# Altium schematic sheet Sheet1.SchDoc
size A3; SheetNumber: 1; SheetTotal: 1
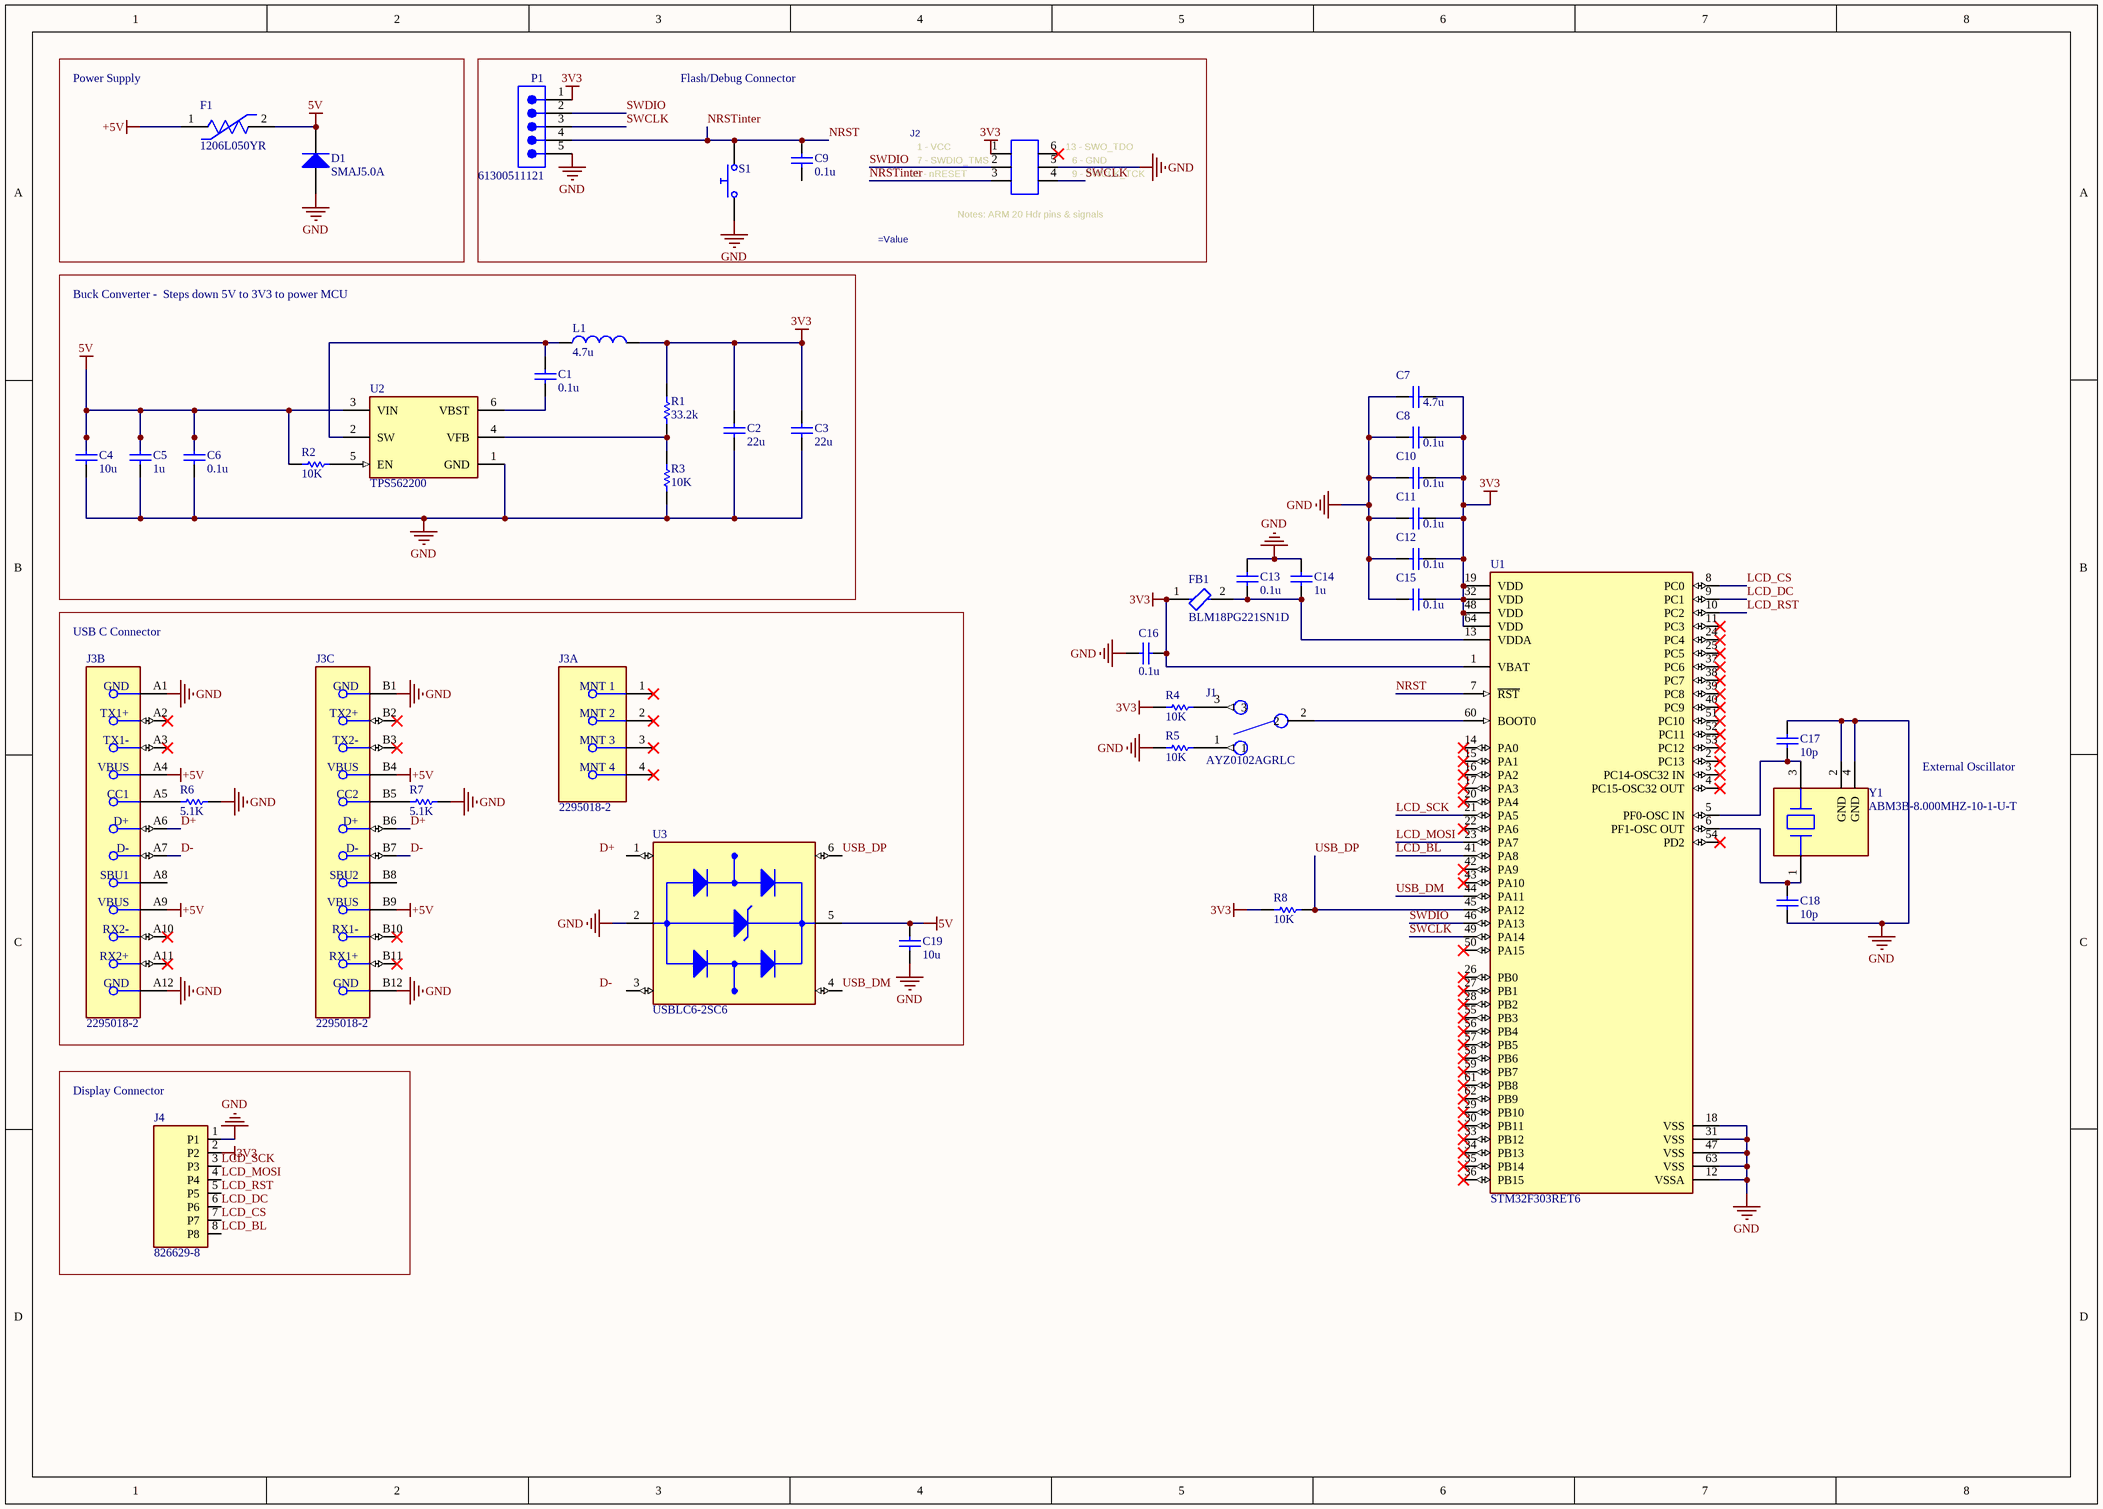
[diagram p0: Sheet1.SchDoc]

## Parts
C1  value 0.1u  (hidden comment: Capacitor)
C2  value 22u  (hidden comment: Capacitor)
C3  value 22u  (hidden comment: Capacitor)
C4  value 10u  (hidden comment: Capacitor)
C5  value 1u  (hidden comment: Capacitor)
C6  value 0.1u  (hidden comment: Capacitor)
C7  value 4.7u  (hidden comment: Capacitor)
C8  value 0.1u  (hidden comment: Capacitor)
C9  value 0.1u  (hidden comment: Capacitor)
C10  value 0.1u  (hidden comment: Capacitor)
C11  value 0.1u  (hidden comment: Capacitor)
C12  value 0.1u  (hidden comment: Capacitor)
C13  value 0.1u  (hidden comment: Capacitor)
C14  value 1u  (hidden comment: Capacitor)
C15  value 0.1u  (hidden comment: Capacitor)
C16  value 0.1u  (hidden comment: Capacitor)
C17  value 10p  (hidden comment: Capacitor)
C18  value 10p  (hidden comment: Capacitor)
C19  value 10u  (hidden comment: Capacitor)
D1  SMAJ5.0A  [BOUR-SMA-2_V]
F1  1206L050YR  [FP-1206L050YR-MFG]
FB1  BLM18PG221SN1D  [FP-BLM18-0_15-t0_8-IPC_B]
J1  AYZ0102AGRLC  [SW_AYZ0102AGRLC]
J2  (no value)  [TC2030-IDC]  (no BOM)
J3  2295018-2  [FP-2295018-2-MFG]  (parts A,B,C of 3)
J4  826629-8  [TE_826629-8]
L1  value 4.7u  (hidden comment: Inductor)
P1  61300511121  [61300511121]
R1  value 33.2k  (hidden comment: Resistor)
R2  value 10K  (hidden comment: Resistor)
R3  value 10K  (hidden comment: Resistor)
R4  value 10K  (hidden comment: Resistor)
R5  value 10K  (hidden comment: Resistor)
R6  value 5.1K  (hidden comment: Resistor)
R7  value 5.1K  (hidden comment: Resistor)
R8  value 10K  (hidden comment: Resistor)
S1  Push Button Normally Opened  (value not drawn)
U1  STM32F303RET6  [FP-LQFP64-5W-MFG]
U2  TPS562200  [FP-DDC0006A-MFG]
U3  USBLC6-2SC6  [SOT95P280X145-6N]
Y1  ABM3B-8.000MHZ-10-1-U-T  [FP-ABM3B-MFG]

## Blocks framed on the sheet
Power Supply: D1 F1
Flash/Debug Connector: C9 J2 P1 S1
Buck Converter -  Steps down 5V to 3V3 to power MCU: C1-C6 L1 R1-R3 U2
USB C Connector: C19 J3 R6 R7 U3
Display Connector: J4

## Nets
3V3: C2.2 C3.2 C7.1 C8.1 C10.1 C11.1 C12.1 C15.1 C16.2 FB1.1 J2.1 J4.2(P2) L1.2 P1.1 R1.1 R4.1 R8.1 U1.1(VBAT) U1.19(VDD) U1.32(VDD) U1.48(VDD) U1.64(VDD)
5V: C4.2 C5.2 C6.2 C19.2 D1.2(K) F1.2 R2.2 U2.3(VIN) U3.5(VBUS)
+5V: F1.1 J3.A4(VBUS) J3.A9(VBUS) J3.B4(VBUS) J3.B9(VBUS)
GND: C2.1 C3.1 C4.1 C5.1 C6.1 C7.2 C8.2 C10.2 C11.2 C12.2 C13.1 C14.2 C15.2 C16.1 C17.1 C18.2 C19.1 D1.1(A) J2.5 J3.A1(GND) J3.A12(GND) J3.B1(GND) J3.B12(GND) J4.1(P1) P1.5 R3.2 R5.1 R6.1 R7.1 S1.1 U1.12(VSSA) U1.18(VSS) U1.31(VSS) U1.47(VSS) U1.63(VSS) U2.1(GND) U3.2(GND) Y1.2(GND) Y1.4(GND)
D+: J3.A6(D+) J3.B6(D+)
D-: J3.A7(D-) J3.B7(D-)
LCD_BL: J4.8(P8) U1.41(PA8)
LCD_CS: J4.7(P7) U1.8(PC0)
LCD_DC: J4.6(P6) U1.9(PC1)
LCD_MOSI: J4.4(P4) U1.23(PA7)
LCD_RST: J4.5(P5) U1.10(PC2)
LCD_SCK: J4.3(P3) U1.21(PA5)
NRST: C9.2 J2.3 P1.4 S1.2 U1.7(~{RST})  [also labelled NRSTinter]
SWCLK: J2.4 P1.3 U1.49(PA14)
SWDIO: J2.2 P1.2 U1.46(PA13)
USB_DM: U1.44(PA11) U3.4(I/O2_OUT)
USB_DP: R8.2 U1.45(PA12) U3.6(I/O1_OUT)
NetC1_1: C1.1 U2.6(VBST)
NetC1_2: C1.2 L1.1 U2.2(SW)
NetC13_2: C13.2 C14.1 FB1.2 U1.13(VDDA)
NetC17_2: C17.2 U1.5(PF0-OSC_IN) Y1.3
NetC18_1: C18.1 U1.6(PF1-OSC_OUT) Y1.1
NetJ1_1: J1.1 R5.2
NetJ1_2: J1.2 U1.60(BOOT0)
NetJ1_3: J1.3 R4.2
NetJ3_A5: J3.A5(CC1) R6.2
NetJ3_B5: J3.B5(CC2) R7.2
NetR1_2: R1.2 R3.1 U2.4(VFB)
NetR2_1: R2.1 U2.5(EN)

Not connected (* = marked no-connect by the designer): C9 1; J2 6*; J3 1(MNT_1)* 2(MNT_2)* 3(MNT_3)* 4(MNT_4)* A2(TX1+)* A3(TX1-)* A8(SBU1) A10(RX2-)* A11(RX2+)* B2(TX2+)* B3(TX2-)* B8(SBU2) B10(RX1-)* B11(RX1+)*; U1 2(PC13)* 3(PC14-OSC32_IN)* 4(PC15-OSC32_OUT)* 11(PC3)* 14(PA0)* 15(PA1)* 16(PA2)* 17(PA3)* 20(PA4)* 22(PA6)* 24(PC4)* 25(PC5)* 26(PB0)* 27(PB1)* 28(PB2)* 29(PB10)* 30(PB11)* 33(PB12)* 34(PB13)* 35(PB14)* 36(PB15)* 37(PC6)* 38(PC7)* 39(PC8)* 40(PC9)* 42(PA9)* 43(PA10)* 50(PA15)* 51(PC10)* 52(PC11)* 53(PC12)* 54(PD2)* 55(PB3)* 56(PB4)* 57(PB5)* 58(PB6)* 59(PB7)* 61(PB8)* 62(PB9)*; U3 1(I/O1_IN) 3(I/O2_IN)

## Notes on the sheet
- External Oscillator
- Labels drawn without touching a wire or pin: D+, D-
- (in symbol HDR 6 TC2030-NL) 1 - VCC; 13 - SWO_TDO; 7 - SWDIO_TMS; 6 - GND; 15 - nRESET; 9 - SWCLK_TCK; Notes: ARM 20 Hdr pins & signals

## Library data of the parts
C1-C19 = Capacitor: SimulationGenericComponent: True
D1 = CMP-2000-07090-1: SMAJ Transient Voltage Suppressor Diode Series, 3.5 V, -55 to 150 degC, 2-Pin SMA, RoHS, Tape and Reel; Manufacturer: Bourns; EDA / CAD Models: DownloadfromAcceleratedDesigns; Unidirectional Channels: 1; Voltage - Breakdown (Min): 6.4V; Voltage - Reverse Standoff (Typ): 5V; Voltage - Clamping (Max) @ Ipp: 9.2V; Other Names: SMAJ5.0ABDKR; Type: Zener; Catalog Drawings: SMAJSeriesFootprintSMAJ,SMBJSeries; Featured Product: SMAJ/SMBJ/SMCJ/SMLJDiscreteTVSDiodes; Power - Peak Pulse: 400W; Current - Peak Pulse (10/1000µs): 43.5A; Power Line Protection: No; Online Catalog: SMAJSeries; Supplier Device Package: SMA(DO-214AC); Operating Temperature: -55°C~150°C(TJ); Package Description: 2-Pin Surface Mount Device, Body 4.315 x 2.605 mm; Datasheet URL: https://datasheet.ciiva.com/25624/0900766b8112213b-25624680.pdf; Manufacturer URL: http://www.bourns.com/; Datasheet Version: 08/2012; Series: SMAJ; Family: TVS-Diodes; Bidirectional Channels: -; Applications: GeneralPurpose; Package Reference: SMA-2; Standard Package: 1; Package / Case: DO-214AC,SMA; Category: CircuitProtection; RoHS Information: SMAJSeriesMaterialDeclaration; Mounting Technology: SurfaceMount; Capacitance @ Frequency: -; Packaging: Digi-Reel®; Mounting Type: SurfaceMount
F1 = CMP-08606-000073-1: PTC RESET FUSE 6V 500MA 1206; Trip Current: 1A; Current Rating: 100A; Resistance: 700mR; Approvals: cULus; Max Power Dissipation: 600mW; Time to Trip: 0.1s; Hold Current: 500mA; Min Operating Temperature: -40°C; Voltage Rating (DC): 6V; Working Voltage: 6V; Package Quantity: 4000; Termination: SMD/SMT; Lead Free: Lead Free; REACH SVHC: No SVHC; Series: 1206L; Max Voltage Rating (DC): 6V; Height: 0.75mm; Terminal Material: Copper; Packaging: Tape and Reel; Case Code (Imperial): 1206; Length: 3.4mm; RoHS Compliant: Yes; Operating Supply Voltage: 6V; Case Code (Metric): 3216; Width: 1.8mm; Max Current Rating: 100A; Case/Package: 1206; Power Dissipation: 600mW; Max Operating Temperature: 85°C; Voltage Rating: 6V
FB1 = CMP-0686-00569-3: Chip Ferrite Bead, 0603, 220Ω @ 100MHz, 0.1Ω, 25%, 1.4A; Manufacturer Series: BLM18P; Number of Functions: 1; Shielding: Unshielded; ESR (Equivalent Series Resistance): 220R; Material: Steel; DC Resistance-Max: 100mR; Lead Free: Lead Free; Current Rating: 1.4A; Test Frequency: 100MHz; Package Quantity: 1; REACH SVHC: No SVHC; Series: BLM18P; Number of Circuits: 1; Height: 0.8mm; Number of Pins: 2; Termination: SMD/SMT; Width: 0.8mm; Max DC Current: 1.4A; Depth: 0.8mm; RoHS Compliant: Yes; Case Code (Imperial): 0603; Number of Lines: 1; Length: 1.6mm; Max Current Rating: 1.4A; Case/Package: 0603; DC Current: 1.4A; Max Operating Temperature: 125°C; Weight: 7.1E-05oz; Tolerance: 25%; Impedance: 220R; Radiation Hardening: No; Packaging: Tape and Reel; DC Resistance (DCR): 100mR; Resistance: 100mR; Min Operating Temperature: -55°C; Core Material: Ferrite; Case Code (Metric): 1608
J1 = AYZ0102AGRLC: Slide Switch SPDT Surface Mount, Right Angle; MF: C&K; SnapEDA_Link: https://www.snapeda.com/parts/AYZ0102AGRLC/C&K/view-part/50616/?ref=snap; Price: None; Check_prices: https://www.snapeda.com/parts/AYZ0102AGRLC/C&K/view-part/50616/?ref=eda; Availability: Good; Value: *; MP: AYZ0102AGRLC; Package: None; Purchase-URL: https://pricing.snapeda.com/search/part/AYZ0102AGRLC/?ref=eda
J2 = HDR 6 TC2030-NL: HDR, TC2030, 6 Pin, Footprint only; Mfg-1: Tag-Connect; Mfg-1-P/N: TC2030-IDC-NL
J3 = CMP-03360-000011-1: CONN RCPT USB3.1 TYPEC 24POS SMD; Plating: Bright; Contact Current Rating: 5A; Connector System: Cable-to-Board; Number of Ports: 1; Circuit Application: Signal; Number of Positions: 24; Gender: Receptacle; Pitch: 0.5mm; Lead Free: Lead Free; Packaging: Tape and Reel; Min Operating Temperature: -30°C; RoHS Compliant: Yes; Housing Color: Black; Housing Material: Thermoplastic; Orientation: Right Angle; Connector Type: Receptacle; Max Operating Temperature: 85°C; USB Standard: USB 3.1; Contact Material: Copper Alloy; Contact Plating: Gold; Termination: SMD/SMT
J4 = 826629-8: Conn Unshrouded Header HDR 8 POS 2.54mm Solder ST Thru-Hole Automotive Box; MF: TE Connectivity; Value: *; SnapEDA_Link: https://www.snapeda.com/parts/826629-8/TE+Connectivity+AMP+Connectors/view-part/?ref=snap; Purchase-URL: https://pricing.snapeda.com/search/part/826629-8/?ref=eda; EU_RoHS_Compliance: Compliant; Availability: In Stock; Price: None; Package: None; Check_prices: https://www.snapeda.com/parts/826629-8/TE+Connectivity+AMP+Connectors/view-part/?ref=eda; MP: 826629-8
L1 = Inductor: SimulationGenericComponent: True
P1 = CMP-1502-01068-4: THT Vertical Pin Header WR-PHD, Pitch 2.54 mm, Single Row, 5 pins; Number of Contacts: 5; Connector Type: Male Pin; Operating Supply Voltage: 250V; Contact Resistance: 20mΩ; Gender: Male; Pitch: 2.54mm; Current Rating: 3A; Min Operating Temperature: -40°C; Contact Material: Gold; Color: Black; RoHS: Compliant; Number of Rows: 1; Lead Free: Lead Free; Height: 8.89mm; Contact Plating: Gold; Number of Pins: 5; Orientation: Vertical; Voltage Rating: 250V; Packaging: Bulk; Number of Positions: 5; Max Operating Temperature: 105°C; Termination: Solder; Lead Pitch: 2.54mm; Contact Mating Length: 5.9944mm; Mount: Through Hole
R1-R8 = Resistor: TC1: 0; SimulationGenericComponent: True; TC2: 0
S1 = Push Button NO: closed: 0; Rclosed: 1m; Ropen: 1Meg; SimulationGenericComponent: True
U1 = CMP-0537-00048-2: IC MCU 32BIT 512KB FLASH 64LQFP; Manufacturer: STMicroelectronics; Data Bus Width: 32bits; Standoff Height: 0.05mm; Number Of Pwm Channels: 31; Number Of Timers/Counters: 6; Min Supply Voltage: 2V; Number Of Spi Channels: 4; Core Architecture: ARM Cortex-M4; Number Of I2C Channels: 3; Number Of Usb Channels: 1; Max Supply Voltage: 3.6V; Interface: I2C,SPI,UART,USART,CAN,USB,LIN,IrDA,I2S; Frequency: 72MHz; Max Junction Temp: +105°C; Number Of Uart Channels: 2; Number Of I/Os: 26; Memory Size: 512KBytes; Number Of Adc Channels: 22; Ram Size: 80KBytes; Nominal Supply Current: 4.27-66.4mA; Actuator Length: 990.6µm; Contact Resistance: 80mΩ; Electrical Life: 10kcycles; Insulation Resistance: 100MΩ; Max Current Rating: 100mA; Max Voltage Rating (DC): 12V; Throw Configuration: SPDT; ComponentLink2URL: https://www.st.com/resource/en/datasheet/stm32f303re.pdf; Automotive: No; Mouser Description: MCU 32-Bit STM32 ARM Cortex M4 RISC 512KB Flash 2.5V/3.3V 64-Pin LQFP Tray; Memory Type: FLASH; Temperature: -40°C to +105°C; Temperature Range Low: -40°C; Manufacturer Part Number: STM32F303RET6; Number Of A/D Converters: 4; Ambient Temperature Range High: +85°C; RoHS: TRUE; Category: IC; Ambient Temperature Range Low: -40°C; Number Of Cores: 1; Octopart: https://octopart.com/stm32f303ret6-stmicroelectronics-53115257; Height: 1.6mm; Device Class L2: Embedded Processors and Controllers; Device Class L3: Microcontrollers; Temperature Range High: +105°C; ComponentLink2Description: Datasheet; Lead Free: Yes; Digikey Description: IC MCU 32BIT 512KB FLASH 64LQFP; Package: LQFP64-5W; Device Class L1: Integrated Circuits (ICs); Supplier: Arrow Electronics; Supplier Part Number: AYZ0102AGRLC; Stock: 16000; Pricing: 16000=0.8019 (USD); China RoHS: Compliant; Contact Material: Brass; Contact Plating: Silver; Country of Origin: Vietnam; Export Control Classification Number (ECCN) Code: EAR99; Harmonized Tariff Schedule (HTS) Code: 8536.50.70.00; Length: 7.2mm; Lifecycle Status: Production; Max Operating Temperature: 60°C; Min Operating Temperature: -10°C; Number of Positions: 2; Packaging: Tape and Reel; REACH SVHC: Unaffected; Termination: Solder; ComponentLink1URL: https://datasheet.octopart.com:443/AYZ0102AGRLC-Littelfuse-datasheet-154730551.pdf?src-supplier=Master+Electronics; ComponentLink1Description: https://datasheet.octopart.com:443/AYZ0102AGRLC-Littelfuse-datasheet-154730551.pdf?src-supplier=Master+Electronics; ComponentLink3URL: https://datasheet.octopart.com:443/AYZ0102AGRLC-Littelfuse-datasheet-62111143.pdf?src-supplier=Master+Electronics; ComponentLink3Description: https://datasheet.octopart.com:443/AYZ0102AGRLC-Littelfuse-datasheet-62111143.pdf?src-supplier=Master+Electronics
U2 = CMP-04918-000010-1: IC REG BUCK ADJ 2A TSOT23-6; Manufacturer Part Number: TPS562201DDCT; Manufacturer: Texas Instruments; Min Supply Voltage: 4.5V; Nominal Supply Current: 380uA; Output Type: AdjustableProgrammable; Standoff Height: 0mm; Max Supply Voltage: 17V; Output Voltage: 0.76-7V; Max Duty Cycle: 80%; Switching Frequency: 580kHz; Number Of Outputs: 1; Max Junction Temp: +125°C; Temperature Range Low: -40°C; Device Class L2: Power Management ICs; Package: DDC0006A; Switching Topology: Buck; Category: IC; RoHS: TRUE; Digikey Description: IC REG BUCK ADJ 2A TSOT23-6; Height: 1.1mm; Temperature: -40°C to +125°C; Temperature Range High: +125°C; Octopart: https://octopart.com/tps562201ddct-texas+instruments-68059584; Lead Free: Yes; ComponentLink2URL: http://www.ti.com/lit/ds/symlink/tps562201.pdf; Device Class L3: Voltage Regulators - Switching; Device Class L1: Integrated Circuits (ICs); Output Current: 2A; ComponentLink2Description: Datasheet; Mouser Description: Conv DC-DC 4.5V to 17V Synchronous Step Down Single-Out 0.76V to 7V 2A 6-Pin TSOT-23 T/R; Automotive: No
U3 = USBLC6-2SC6: 17V Clamp 5A (8/20Âµs) Ipp Tvs Diode Surface Mount SOT-23-6; MF: STMicroelectronics; Value: *; SnapEDA_Link: https://www.snapeda.com/parts/USBLC6-2SC6/STMicroelectronics/view-part/?ref=snap; Check_prices: https://www.snapeda.com/parts/USBLC6-2SC6/STMicroelectronics/view-part/?ref=eda; Purchase-URL: https://pricing.snapeda.com/search/part/USBLC6-2SC6/?ref=eda; Price: None; Availability: In Stock; Package: SOT-23-6 STMicroelectronics; MP: USBLC6-2SC6
Y1 = CMP-2000-05730-2: Crystal 8MHz ±10ppm 10pF SMD-4 5mm x 3.2mm; Series Resistance: 200R; Load Capacitance: 10pF; Max Operating Temperature: 60°C; Frequency: 8MHz; Height - Seated (Max): 0.043inch; Frequency Tolerance: 10ppm; Packaging: Tape and Reel; Lead Free: Lead Free; Case/Package: SMD/SMT; Series: ABM3B; Min Operating Temperature: -10°C; REACH SVHC: No SVHC; Length: 0.197inch; RoHS Compliant: Yes; Depth: 3.2mm; Height: 0.043inch; Number of Pins: 4; Mount: Surface Mount; Frequency Stability: 10ppm; Width: 0.126inch; ESR (Equivalent Series Resistance): 200R